# Altium schematic sheet Sheet2.SchDoc
size A
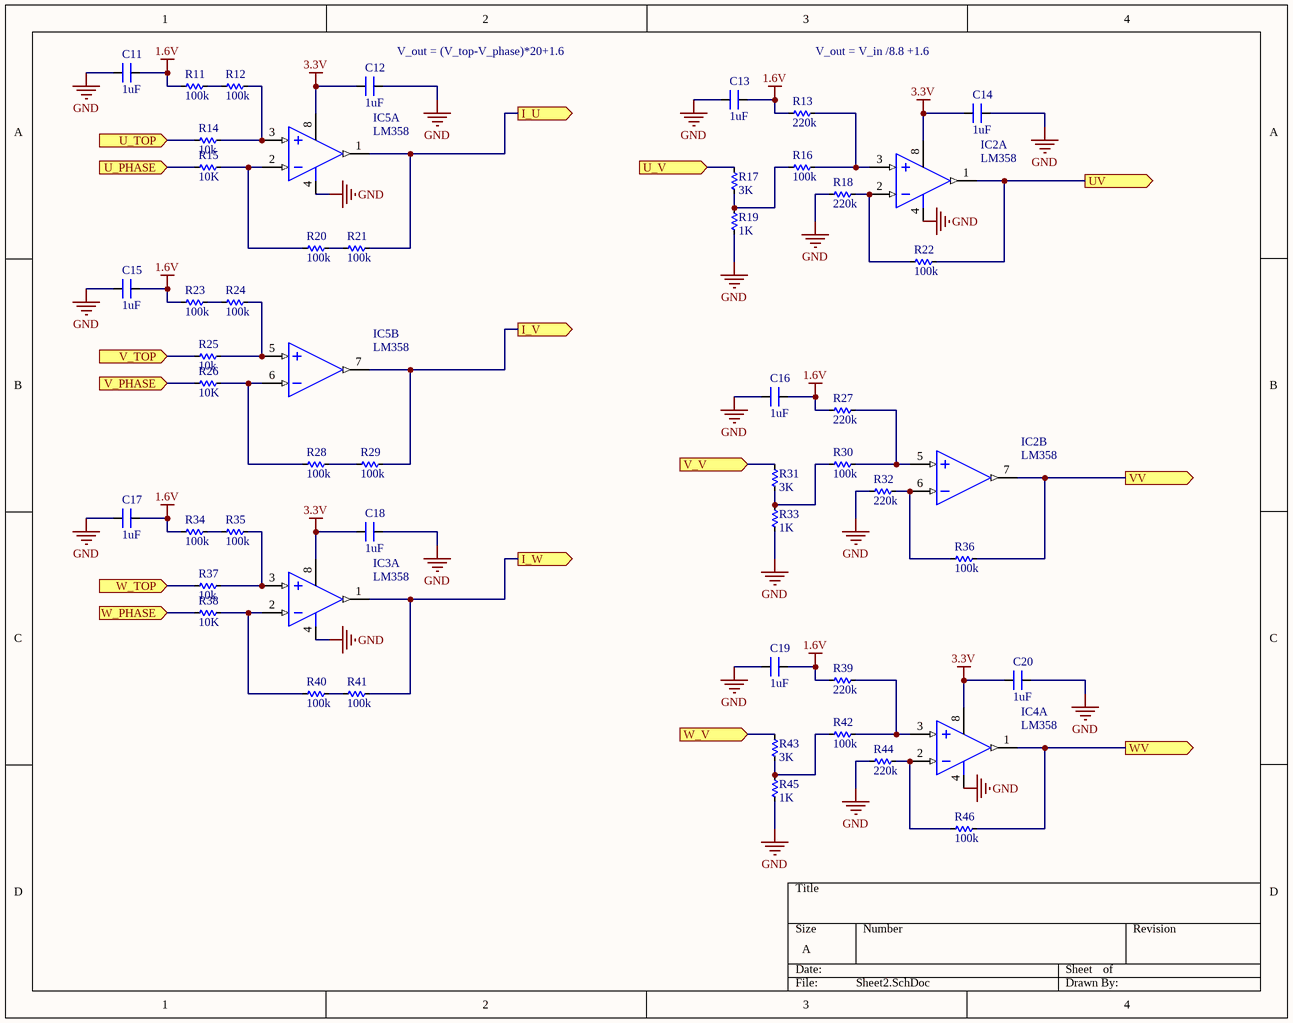
[diagram p0: Sheet2.SchDoc]

## Parts
C11  1uF  [CN1]
C12  1uF  [CN1]
C13  1uF  [CN1]
C14  1uF  [CN1]
C15  1uF  [CN1]
C16  1uF  [CN1]
C17  1uF  [CN1]
C18  1uF  [CN1]
C19  1uF  [CN1]
C20  1uF  [CN1]
IC2  LM358  [DIP8]  (parts A,B of 2)
IC3  LM358  [DIP8]  (part A of 2)
IC4  LM358  [DIP8]  (part A of 2)
IC5  LM358  [DIP8]  (parts A,B of 2)
R11  100k  [RES-1/2W]
R12  100k  [RES-1/2W]
R13  220k  [RES-1/2W]
R14  10k  [RES-1/2W]
R15  10K  [RES-1/2W]
R16  100k  [RES-1/2W]
R17  3K  [RES-1/2W]
R18  220k  [RES-1/2W]
R19  1K  [RES-1/2W]
R20  100k  [RES-1/2W]
R21  100k  [RES-1/2W]
R22  100k  [RES-1/2W]
R23  100k  [RES-1/2W]
R24  100k  [RES-1/2W]
R25  10k  [RES-1/2W]
R26  10K  [RES-1/2W]
R27  220k  [RES-1/2W]
R28  100k  [RES-1/2W]
R29  100k  [RES-1/2W]
R30  100k  [RES-1/2W]
R31  3K  [RES-1/2W]
R32  220k  [RES-1/2W]
R33  1K  [RES-1/2W]
R34  100k  [RES-1/2W]
R35  100k  [RES-1/2W]
R36  100k  [RES-1/2W]
R37  10k  [RES-1/2W]
R38  10K  [RES-1/2W]
R39  220k  [RES-1/2W]
R40  100k  [RES-1/2W]
R41  100k  [RES-1/2W]
R42  100k  [RES-1/2W]
R43  3K  [RES-1/2W]
R44  220k  [RES-1/2W]
R45  1K  [RES-1/2W]
R46  100k  [RES-1/2W]

## Ports
I_U (out), I_V (out), I_W (out), U_PHASE (in), U_TOP (in), U_V (in), UV (out), V_PHASE (in), V_TOP (in), V_V (in), VV (out), W_PHASE (in), W_TOP (in), W_V (in), WV (out)

## Nets
1.6V: C11.2 C13.2 C15.2 C16.2 C17.2 C19.2 R11.2 R13.2 R23.2 R27.2 R34.2 R39.2
3.3V: C12.1 C14.1 C18.1 C20.1 IC2.8(+V) IC3.8(+V) IC4.8(+V) IC5.8(+V)
GND: C11.1 C12.2 C13.1 C14.2 C15.1 C16.1 C17.1 C18.2 C19.1 C20.2 IC2.4(-V) IC3.4(-V) IC4.4(-V) IC5.4(-V) R18.2 R19.2 R32.2 R33.2 R44.2 R45.2
I_U: IC5.1(OUT) R21.1 ; port I_U
I_V: IC5.7(OUT) R29.1 ; port I_V
I_W: IC3.1(OUT) R41.1 ; port I_W
U_PHASE: R15.2 ; port U_PHASE
U_TOP: R14.2 ; port U_TOP
U_V: R17.1 ; port U_V
UV: IC2.1(OUT) R22.1 ; port UV
V_PHASE: R26.2 ; port V_PHASE
V_TOP: R25.2 ; port V_TOP
V_V: R31.1 ; port V_V
VV: IC2.7(OUT) R36.1 ; port VV
W_PHASE: R38.2 ; port W_PHASE
W_TOP: R37.2 ; port W_TOP
W_V: R43.1 ; port W_V
WV: IC4.1(OUT) R46.1 ; port WV
NetIC2_2: IC2.2(IN-) R18.1 R22.2
NetIC2_3: IC2.3(IN+) R13.1 R16.1
NetIC2_5: IC2.5(IN+) R27.1 R30.1
NetIC2_6: IC2.6(IN-) R32.1 R36.2
NetIC3_2: IC3.2(IN-) R38.1 R40.2
NetIC3_3: IC3.3(IN+) R35.1 R37.1
NetIC4_2: IC4.2(IN-) R44.1 R46.2
NetIC4_3: IC4.3(IN+) R39.1 R42.1
NetIC5_2: IC5.2(IN-) R15.1 R20.2
NetIC5_3: IC5.3(IN+) R12.1 R14.1
NetIC5_5: IC5.5(IN+) R24.1 R25.1
NetIC5_6: IC5.6(IN-) R26.1 R28.2
NetR11_1: R11.1 R12.2
NetR16_2: R16.2 R17.2 R19.1
NetR20_1: R20.1 R21.2
NetR23_1: R23.1 R24.2
NetR28_1: R28.1 R29.2
NetR30_2: R30.2 R31.2 R33.1
NetR34_1: R34.1 R35.2
NetR40_1: R40.1 R41.2
NetR42_2: R42.2 R43.2 R45.1

## Notes on the sheet
- (near C12) V_out = (V_top-V_phase)*20+1.6
- V_out = V_in /8.8 +1.6

## Library data of the parts
C11-C20 = CN1: Cap np  1pF - 472pF; Value: 100pF
IC2-IC5 = LM358: Low-Power Dual Operational Amplifier; Value: LM358
R11-R46 = Res: Manufacturer: Generic Components; Class: Passive; SubClass: R; Published: 08/06/2000; Publisher: Altium Hobart Technology Centre